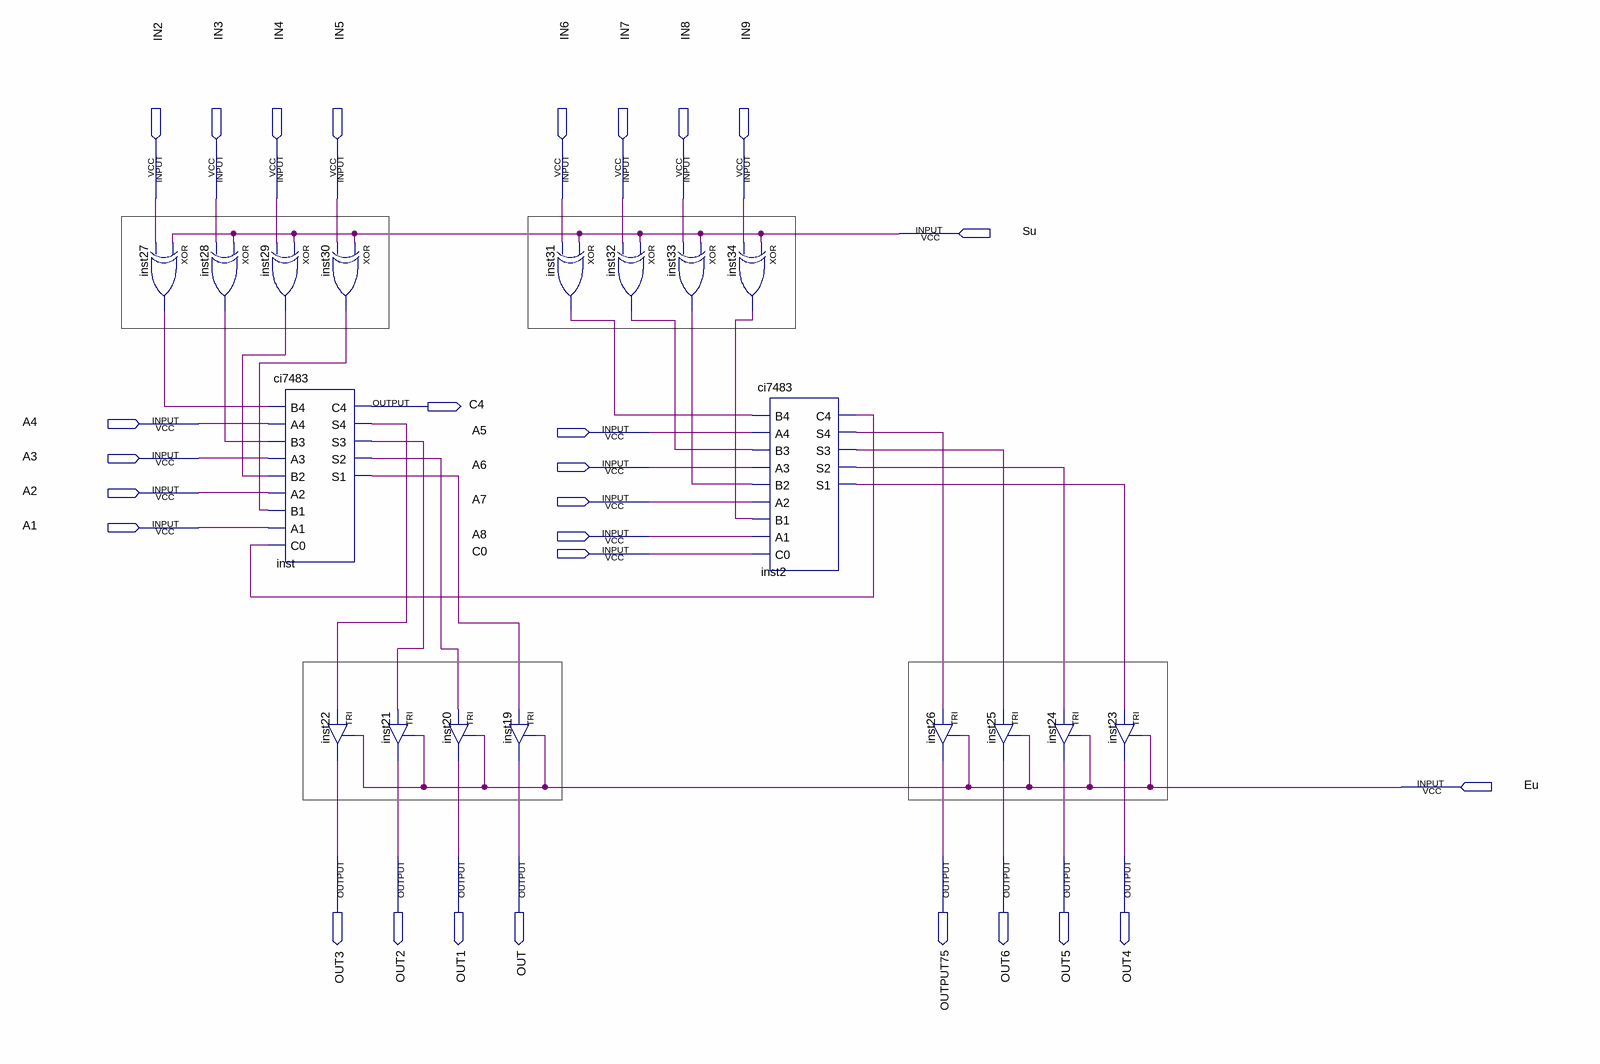
[diagram p0: schematic sheet]
// Quartus schematic Somador Subtrator.bdf as structural Verilog: 18 symbols, 28 pins
module \Somador_Subtrator  (
  input  IN2,
  input  IN3,
  input  IN4,
  input  IN5,
  input  IN6,
  input  IN7,
  input  IN8,
  input  IN9,
  input  Su,
  input  A4,
  input  A5,
  input  A3,
  input  A6,
  input  A2,
  input  A7,
  input  A1,
  input  A8,
  input  C0,
  input  Eu,
  output C4,
  output OUT3,
  output OUT2,
  output OUT1,
  output OUT,
  output OUTPUT75,
  output OUT6,
  output OUT5,
  output OUT4
);

  wire inst2_c4, inst2_s1, inst2_s2, inst2_s3, inst2_s4, inst27_out, inst28_out, inst29_out, inst30_out,
       inst31_out, inst32_out, inst33_out, inst34_out, inst_s1, inst_s2, inst_s3, inst_s4;

  xor inst27 (inst27_out, Su, IN2);
  xor inst28 (inst28_out, Su, IN3);
  xor inst29 (inst29_out, Su, IN4);
  ci7483 inst (
    .B4(inst27_out), .A4(A4), .B3(inst28_out), .A3(A3), .B2(inst29_out), .A2(A2), .B1(inst30_out), .A1(A1),
    .C0(inst2_c4), .C4(C4), .S4(inst_s4), .S3(inst_s3), .S2(inst_s2), .S1(inst_s1));
  xor inst30 (inst30_out, Su, IN5);
  TRI inst21 (.IN(inst_s3), .OE(Eu), .OUT(OUT2));
  TRI inst22 (.IN(inst_s4), .OE(Eu), .OUT(OUT3));
  TRI inst20 (.IN(inst_s2), .OE(Eu), .OUT(OUT1));
  TRI inst19 (.IN(inst_s1), .OE(Eu), .OUT(OUT));
  xor inst31 (inst31_out, Su, IN6);
  xor inst32 (inst32_out, Su, IN7);
  xor inst33 (inst33_out, Su, IN8);
  xor inst34 (inst34_out, Su, IN9);
  ci7483 inst2 (
    .B4(inst31_out), .A4(A5), .B3(inst32_out), .A3(A6), .B2(inst33_out), .A2(A7), .B1(inst34_out), .A1(A8),
    .C0(C0), .C4(inst2_c4), .S4(inst2_s4), .S3(inst2_s3), .S2(inst2_s2), .S1(inst2_s1));
  TRI inst26 (.IN(inst2_s4), .OE(Eu), .OUT(OUTPUT75));
  TRI inst25 (.IN(inst2_s3), .OE(Eu), .OUT(OUT6));
  TRI inst24 (.IN(inst2_s2), .OE(Eu), .OUT(OUT5));
  TRI inst23 (.IN(inst2_s1), .OE(Eu), .OUT(OUT4));
endmodule
